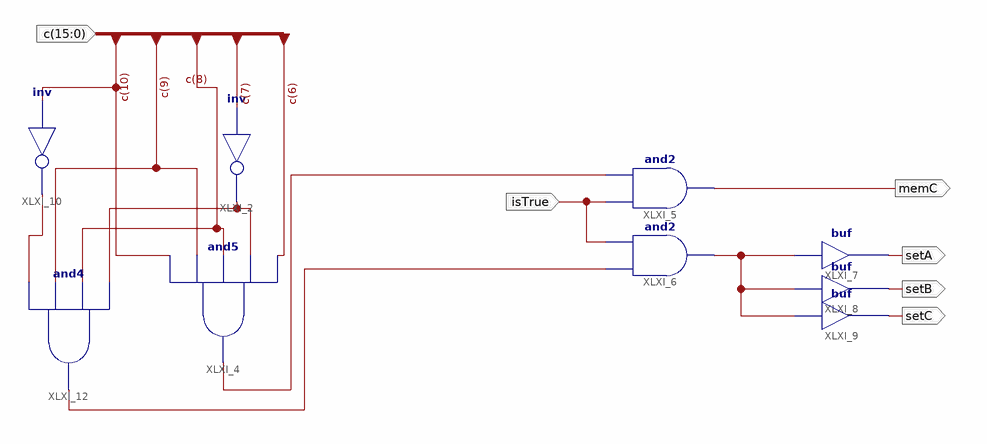
[diagram p0: schematic sheet 1]
// Xilinx ISE schematic CLR.sch (spartan3e) as structural Verilog: 9 symbols, 6 ports
module CLR (
  input  [15:0] c,
  input  isTrue,
  output memC,
  output setA,
  output setB,
  output setC
);

  wire XLXN_23, XLXN_24, XLXN_27, XLXN_35, XLXN_37;

  not XLXI_2 (XLXN_23, c[7]);
  and XLXI_4 (XLXN_24, c[10], c[9], c[8], XLXN_23, c[6]);
  and XLXI_5 (memC, isTrue, XLXN_24);
  and XLXI_6 (XLXN_27, XLXN_37, isTrue);
  buf XLXI_7 (setA, XLXN_27);
  buf XLXI_8 (setB, XLXN_27);
  buf XLXI_9 (setC, XLXN_27);
  not XLXI_10 (XLXN_35, c[10]);
  and XLXI_12 (XLXN_37, XLXN_35, c[9], c[8], XLXN_23);
endmodule
